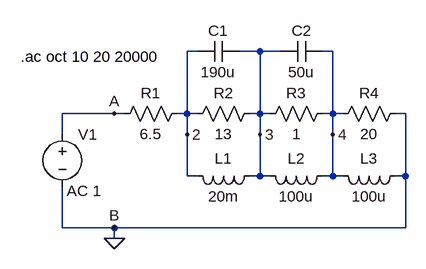
[diagram p0: schematic Speaker.asc]
Speaker.asc, the LTspice schematic file:
Version 4
SHEET 1 880 680
WIRE 96 16 80 16
WIRE 192 16 160 16
WIRE 224 16 192 16
WIRE 304 16 288 16
WIRE -32 112 -112 112
WIRE -16 112 -32 112
WIRE 80 112 80 16
WIRE 80 112 64 112
WIRE 96 112 80 112
WIRE 192 112 192 16
WIRE 192 112 176 112
WIRE 208 112 192 112
WIRE 304 112 304 16
WIRE 304 112 288 112
WIRE 320 112 304 112
WIRE 416 112 400 112
WIRE -112 144 -112 112
WIRE 80 144 80 112
WIRE 192 144 192 112
WIRE 304 144 304 112
WIRE 80 208 80 144
WIRE 96 208 80 208
WIRE 192 208 192 144
WIRE 192 208 176 208
WIRE 208 208 192 208
WIRE 304 208 304 144
WIRE 304 208 288 208
WIRE 320 208 304 208
WIRE 416 208 416 112
WIRE 416 208 400 208
WIRE -112 288 -112 224
WIRE -32 288 -112 288
WIRE 416 288 416 208
WIRE 416 288 -32 288
WIRE -32 304 -32 288
FLAG -32 112 A
FLAG -32 288 B
FLAG 80 144 2
FLAG 192 144 3
FLAG 304 144 4
FLAG -32 304 0
SYMBOL res 80 96 R90
WINDOW 0 0 56 VBottom 0
WINDOW 3 32 56 VTop 0
SYMATTR InstName R1
SYMATTR Value 6.5
SYMBOL res 192 96 R90
WINDOW 0 0 56 VBottom 0
WINDOW 3 32 56 VTop 0
SYMATTR InstName R2
SYMATTR Value 13
SYMBOL ind 192 192 R90
WINDOW 0 5 56 VBottom 0
WINDOW 3 32 56 VTop 0
SYMATTR InstName L1
SYMATTR Value 20m
SYMBOL cap 160 0 R90
WINDOW 0 0 32 VBottom 0
WINDOW 3 32 32 VTop 0
SYMATTR InstName C1
SYMATTR Value 190u
SYMBOL res 304 96 R90
WINDOW 0 0 56 VBottom 0
WINDOW 3 32 56 VTop 0
SYMATTR InstName R3
SYMATTR Value 1
SYMBOL cap 288 0 R90
WINDOW 0 0 32 VBottom 0
WINDOW 3 32 32 VTop 0
SYMATTR InstName C2
SYMATTR Value 50u
SYMBOL ind 304 192 R90
WINDOW 0 5 56 VBottom 0
WINDOW 3 32 56 VTop 0
SYMATTR InstName L2
SYMATTR Value 100u
SYMBOL ind 416 192 R90
WINDOW 0 5 56 VBottom 0
WINDOW 3 32 56 VTop 0
SYMATTR InstName L3
SYMATTR Value 100u
SYMBOL res 416 96 R90
WINDOW 0 0 56 VBottom 0
WINDOW 3 32 56 VTop 0
SYMATTR InstName R4
SYMATTR Value 20
SYMBOL voltage -112 128 R0
WINDOW 123 7 103 Left 0
WINDOW 39 0 0 Left 0
SYMATTR InstName V1
SYMATTR Value ""
SYMATTR Value2 AC 1
TEXT -176 24 Left 0 !.ac oct 10 20 20000

The netlist it stands for:
* Speaker.asc
R1 2 A 6.5
R2 3 2 13
L1 3 2 20m
C1 3 2 190u
R3 4 3 1
C2 4 3 50u
L2 4 3 100u
L3 0 4 100u
R4 0 4 20
V1 A 0 AC 1
.ac oct 10 20 20000
.backanno
.end